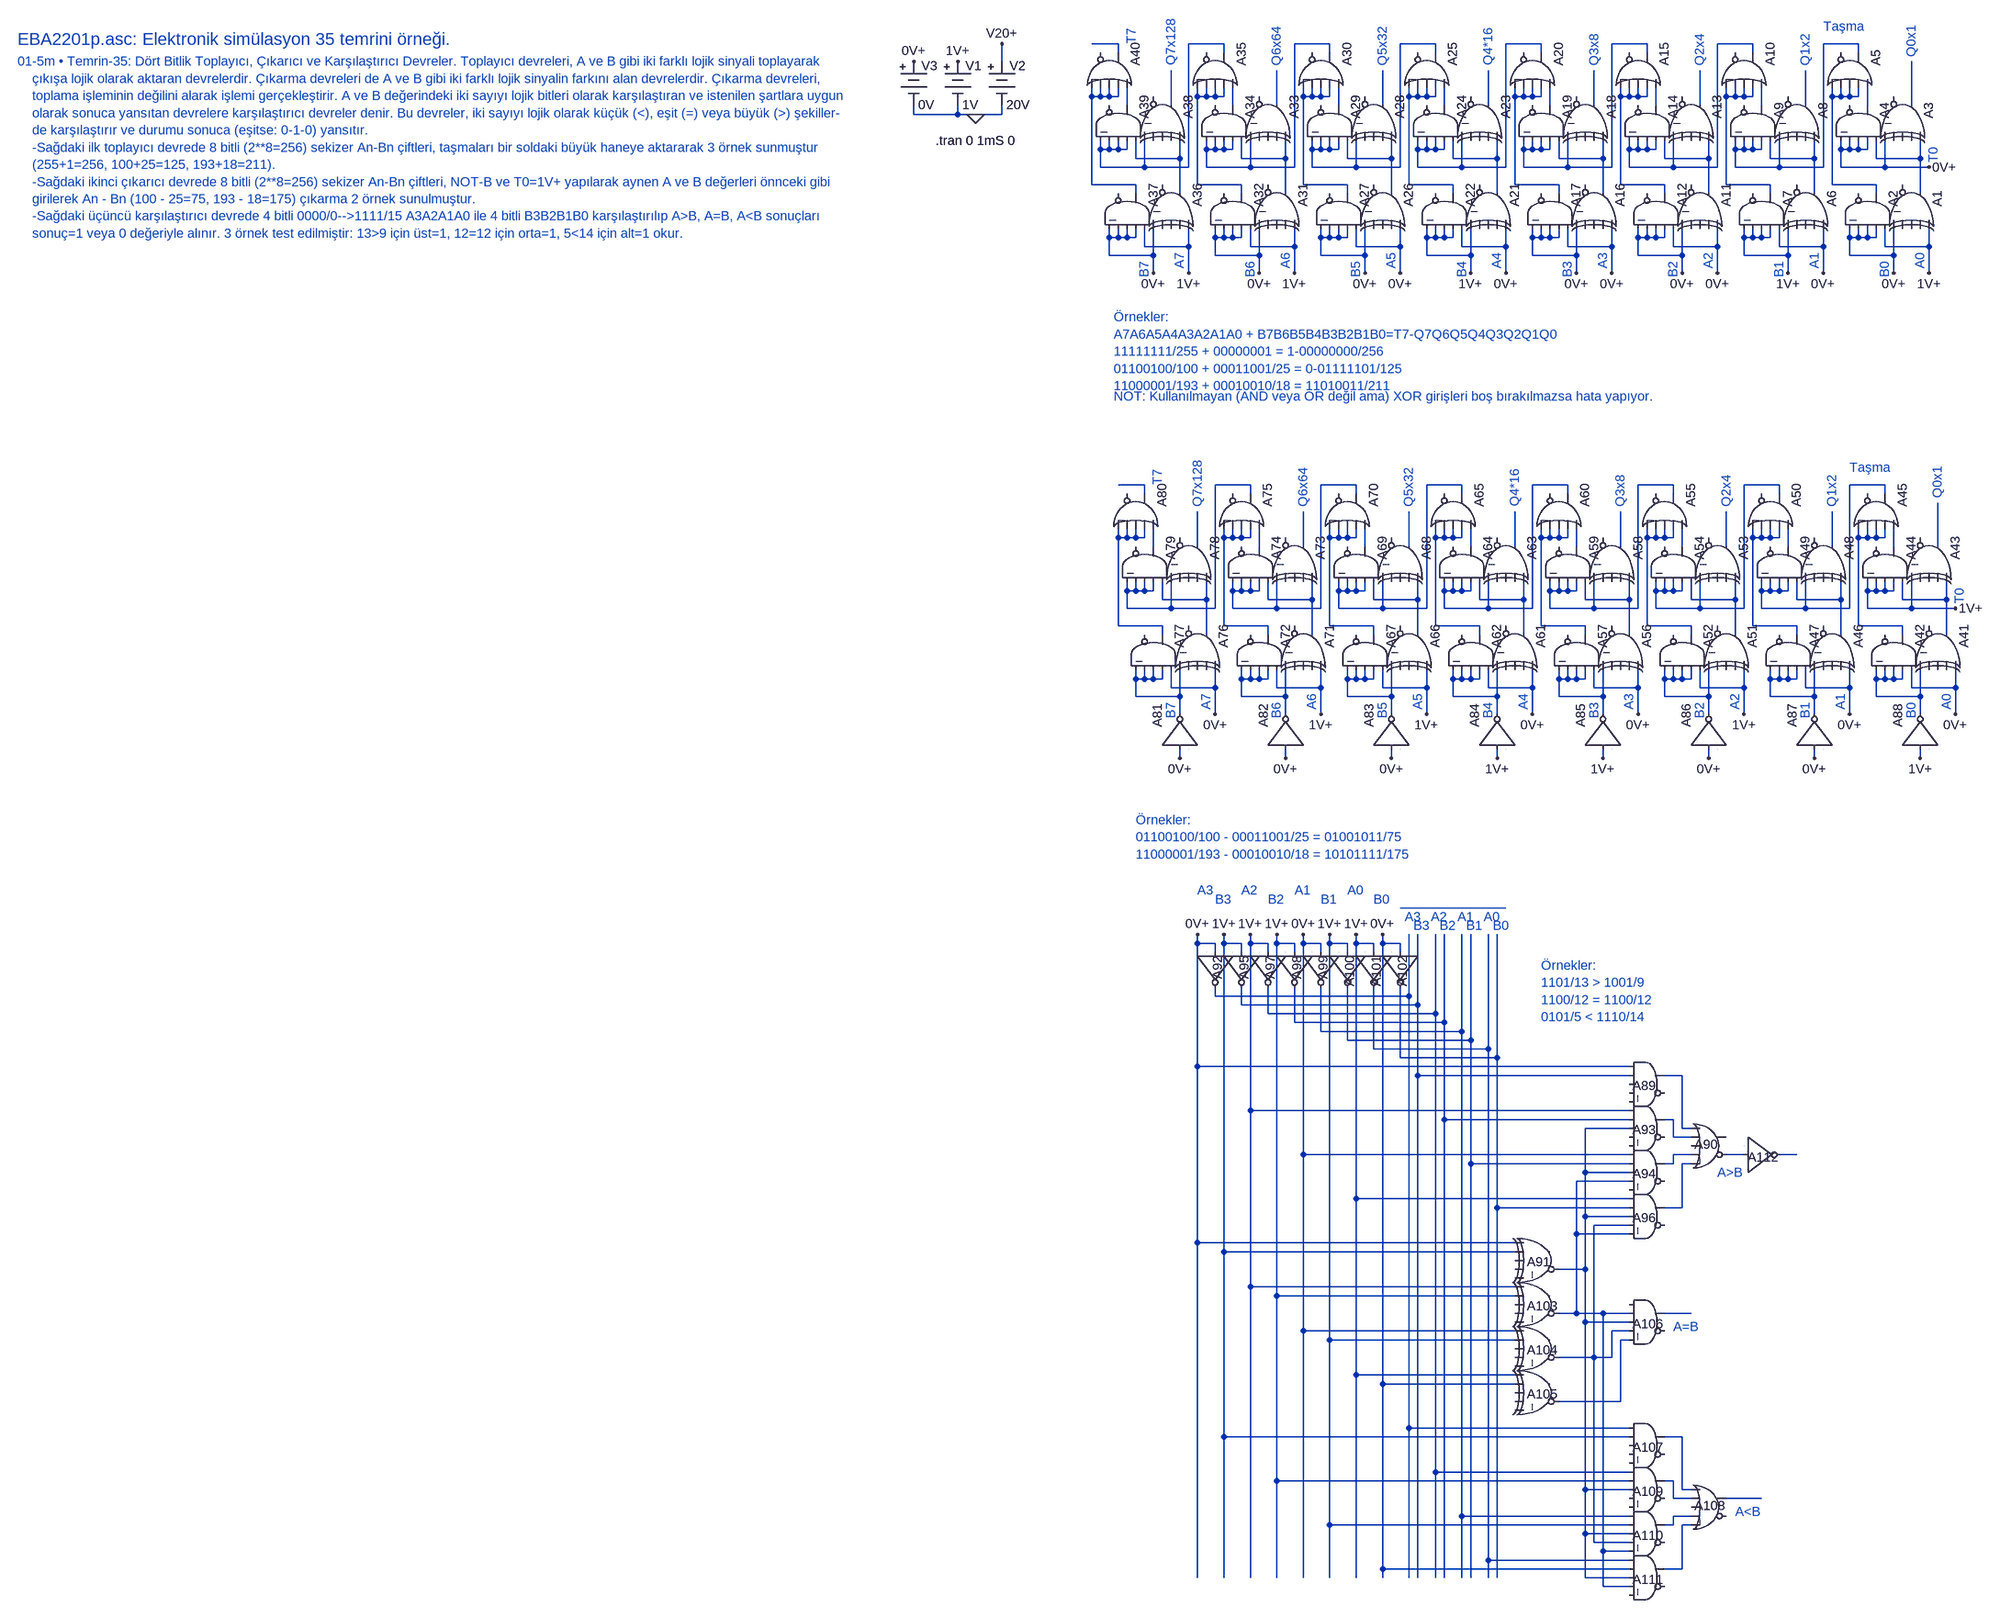
[diagram p0: schematic EBA2201p.asc]
EBA2201p.asc, the LTspice schematic file:
Version 4
SHEET 1 7064 4332
WIRE 2256 64 2208 64
WIRE 2448 64 2384 64
WIRE 2640 64 2576 64
WIRE 2832 64 2768 64
WIRE 3024 64 2960 64
WIRE 3216 64 3152 64
WIRE 3408 64 3344 64
WIRE 3600 64 3536 64
WIRE 2256 80 2256 64
WIRE 2448 80 2448 64
WIRE 2640 80 2640 64
WIRE 2832 80 2832 64
WIRE 3024 80 3024 64
WIRE 3216 80 3216 64
WIRE 3408 80 3408 64
WIRE 3600 80 3600 64
WIRE 1920 96 1920 64
WIRE 2208 160 2208 144
WIRE 2224 160 2224 144
WIRE 2224 160 2208 160
WIRE 2240 160 2240 144
WIRE 2240 160 2224 160
WIRE 2256 160 2256 144
WIRE 2256 160 2240 160
WIRE 2400 160 2400 144
WIRE 2416 160 2416 144
WIRE 2416 160 2400 160
WIRE 2432 160 2432 144
WIRE 2432 160 2416 160
WIRE 2448 160 2448 144
WIRE 2448 160 2432 160
WIRE 2592 160 2592 144
WIRE 2608 160 2608 144
WIRE 2608 160 2592 160
WIRE 2624 160 2624 144
WIRE 2624 160 2608 160
WIRE 2640 160 2640 144
WIRE 2640 160 2624 160
WIRE 2784 160 2784 144
WIRE 2800 160 2800 144
WIRE 2800 160 2784 160
WIRE 2816 160 2816 144
WIRE 2816 160 2800 160
WIRE 2832 160 2832 144
WIRE 2832 160 2816 160
WIRE 2976 160 2976 144
WIRE 2992 160 2992 144
WIRE 2992 160 2976 160
WIRE 3008 160 3008 144
WIRE 3008 160 2992 160
WIRE 3024 160 3024 144
WIRE 3024 160 3008 160
WIRE 3168 160 3168 144
WIRE 3184 160 3184 144
WIRE 3184 160 3168 160
WIRE 3200 160 3200 144
WIRE 3200 160 3184 160
WIRE 3216 160 3216 144
WIRE 3216 160 3200 160
WIRE 3360 160 3360 144
WIRE 3376 160 3376 144
WIRE 3376 160 3360 160
WIRE 3392 160 3392 144
WIRE 3392 160 3376 160
WIRE 3408 160 3408 144
WIRE 3408 160 3392 160
WIRE 3552 160 3552 144
WIRE 3568 160 3568 144
WIRE 3568 160 3552 160
WIRE 3584 160 3584 144
WIRE 3584 160 3568 160
WIRE 3600 160 3600 144
WIRE 3600 160 3584 160
WIRE 2272 176 2272 144
WIRE 2352 176 2352 112
WIRE 2464 176 2464 144
WIRE 2544 176 2544 112
WIRE 2656 176 2656 144
WIRE 2736 176 2736 112
WIRE 2848 176 2848 144
WIRE 2928 176 2928 112
WIRE 3040 176 3040 144
WIRE 3120 176 3120 112
WIRE 3232 176 3232 144
WIRE 3312 176 3312 112
WIRE 3424 176 3424 144
WIRE 3504 176 3504 112
WIRE 3616 176 3616 144
WIRE 3696 176 3696 96
WIRE 1760 192 1760 176
WIRE 1840 192 1840 176
WIRE 1840 192 1760 192
WIRE 1872 192 1840 192
WIRE 1920 192 1920 176
WIRE 1920 192 1872 192
WIRE 2224 256 2224 240
WIRE 2240 256 2240 240
WIRE 2240 256 2224 256
WIRE 2256 256 2256 240
WIRE 2256 256 2240 256
WIRE 2272 256 2272 240
WIRE 2272 256 2256 256
WIRE 2416 256 2416 240
WIRE 2432 256 2432 240
WIRE 2432 256 2416 256
WIRE 2448 256 2448 240
WIRE 2448 256 2432 256
WIRE 2464 256 2464 240
WIRE 2464 256 2448 256
WIRE 2608 256 2608 240
WIRE 2624 256 2624 240
WIRE 2624 256 2608 256
WIRE 2640 256 2640 240
WIRE 2640 256 2624 256
WIRE 2656 256 2656 240
WIRE 2656 256 2640 256
WIRE 2800 256 2800 240
WIRE 2816 256 2816 240
WIRE 2816 256 2800 256
WIRE 2832 256 2832 240
WIRE 2832 256 2816 256
WIRE 2848 256 2848 240
WIRE 2848 256 2832 256
WIRE 2992 256 2992 240
WIRE 3008 256 3008 240
WIRE 3008 256 2992 256
WIRE 3024 256 3024 240
WIRE 3024 256 3008 256
WIRE 3040 256 3040 240
WIRE 3040 256 3024 256
WIRE 3184 256 3184 240
WIRE 3200 256 3200 240
WIRE 3200 256 3184 256
WIRE 3216 256 3216 240
WIRE 3216 256 3200 256
WIRE 3232 256 3232 240
WIRE 3232 256 3216 256
WIRE 3376 256 3376 240
WIRE 3392 256 3392 240
WIRE 3392 256 3376 256
WIRE 3408 256 3408 240
WIRE 3408 256 3392 256
WIRE 3424 256 3424 240
WIRE 3424 256 3408 256
WIRE 3568 256 3568 240
WIRE 3584 256 3584 240
WIRE 3584 256 3568 256
WIRE 3600 256 3600 240
WIRE 3600 256 3584 256
WIRE 3616 256 3616 240
WIRE 3616 256 3600 256
WIRE 2288 272 2288 240
WIRE 2368 272 2368 240
WIRE 2368 272 2288 272
WIRE 2480 272 2480 240
WIRE 2560 272 2560 240
WIRE 2560 272 2480 272
WIRE 2672 272 2672 240
WIRE 2752 272 2752 240
WIRE 2752 272 2672 272
WIRE 2864 272 2864 240
WIRE 2944 272 2944 240
WIRE 2944 272 2864 272
WIRE 3056 272 3056 240
WIRE 3136 272 3136 240
WIRE 3136 272 3056 272
WIRE 3248 272 3248 240
WIRE 3328 272 3328 240
WIRE 3328 272 3248 272
WIRE 3440 272 3440 240
WIRE 3520 272 3520 240
WIRE 3520 272 3440 272
WIRE 3632 272 3632 240
WIRE 3712 272 3712 240
WIRE 3712 272 3632 272
WIRE 2224 288 2224 256
WIRE 2304 288 2304 240
WIRE 2304 288 2224 288
WIRE 2384 288 2384 64
WIRE 2384 288 2304 288
WIRE 2416 288 2416 256
WIRE 2496 288 2496 240
WIRE 2496 288 2416 288
WIRE 2576 288 2576 64
WIRE 2576 288 2496 288
WIRE 2608 288 2608 256
WIRE 2688 288 2688 240
WIRE 2688 288 2608 288
WIRE 2768 288 2768 64
WIRE 2768 288 2688 288
WIRE 2800 288 2800 256
WIRE 2880 288 2880 240
WIRE 2880 288 2800 288
WIRE 2960 288 2960 64
WIRE 2960 288 2880 288
WIRE 2992 288 2992 256
WIRE 3072 288 3072 240
WIRE 3072 288 2992 288
WIRE 3152 288 3152 64
WIRE 3152 288 3072 288
WIRE 3184 288 3184 256
WIRE 3264 288 3264 240
WIRE 3264 288 3184 288
WIRE 3344 288 3344 64
WIRE 3344 288 3264 288
WIRE 3376 288 3376 256
WIRE 3456 288 3456 240
WIRE 3456 288 3376 288
WIRE 3536 288 3536 64
WIRE 3536 288 3456 288
WIRE 3568 288 3568 256
WIRE 3648 288 3648 240
WIRE 3648 288 3568 288
WIRE 3728 288 3648 288
WIRE 2208 320 2208 160
WIRE 2288 320 2208 320
WIRE 2400 320 2400 160
WIRE 2480 320 2400 320
WIRE 2592 320 2592 160
WIRE 2672 320 2592 320
WIRE 2784 320 2784 160
WIRE 2864 320 2784 320
WIRE 2976 320 2976 160
WIRE 3056 320 2976 320
WIRE 3168 320 3168 160
WIRE 3248 320 3168 320
WIRE 3360 320 3360 160
WIRE 3440 320 3360 320
WIRE 3552 320 3552 160
WIRE 3632 320 3552 320
WIRE 2288 336 2288 320
WIRE 2368 336 2368 272
WIRE 2480 336 2480 320
WIRE 2560 336 2560 272
WIRE 2672 336 2672 320
WIRE 2752 336 2752 272
WIRE 2864 336 2864 320
WIRE 2944 336 2944 272
WIRE 3056 336 3056 320
WIRE 3136 336 3136 272
WIRE 3248 336 3248 320
WIRE 3328 336 3328 272
WIRE 3440 336 3440 320
WIRE 3520 336 3520 272
WIRE 3632 336 3632 320
WIRE 3712 336 3712 272
WIRE 2240 416 2240 400
WIRE 2256 416 2256 400
WIRE 2256 416 2240 416
WIRE 2272 416 2272 400
WIRE 2272 416 2256 416
WIRE 2288 416 2288 400
WIRE 2288 416 2272 416
WIRE 2432 416 2432 400
WIRE 2448 416 2448 400
WIRE 2448 416 2432 416
WIRE 2464 416 2464 400
WIRE 2464 416 2448 416
WIRE 2480 416 2480 400
WIRE 2480 416 2464 416
WIRE 2624 416 2624 400
WIRE 2640 416 2640 400
WIRE 2640 416 2624 416
WIRE 2656 416 2656 400
WIRE 2656 416 2640 416
WIRE 2672 416 2672 400
WIRE 2672 416 2656 416
WIRE 2816 416 2816 400
WIRE 2832 416 2832 400
WIRE 2832 416 2816 416
WIRE 2848 416 2848 400
WIRE 2848 416 2832 416
WIRE 2864 416 2864 400
WIRE 2864 416 2848 416
WIRE 3008 416 3008 400
WIRE 3024 416 3024 400
WIRE 3024 416 3008 416
WIRE 3040 416 3040 400
WIRE 3040 416 3024 416
WIRE 3056 416 3056 400
WIRE 3056 416 3040 416
WIRE 3200 416 3200 400
WIRE 3216 416 3216 400
WIRE 3216 416 3200 416
WIRE 3232 416 3232 400
WIRE 3232 416 3216 416
WIRE 3248 416 3248 400
WIRE 3248 416 3232 416
WIRE 3392 416 3392 400
WIRE 3408 416 3408 400
WIRE 3408 416 3392 416
WIRE 3424 416 3424 400
WIRE 3424 416 3408 416
WIRE 3440 416 3440 400
WIRE 3440 416 3424 416
WIRE 3584 416 3584 400
WIRE 3600 416 3600 400
WIRE 3600 416 3584 416
WIRE 3616 416 3616 400
WIRE 3616 416 3600 416
WIRE 3632 416 3632 400
WIRE 3632 416 3616 416
WIRE 2304 432 2304 400
WIRE 2384 432 2384 400
WIRE 2384 432 2304 432
WIRE 2496 432 2496 400
WIRE 2576 432 2576 400
WIRE 2576 432 2496 432
WIRE 2688 432 2688 400
WIRE 2768 432 2768 400
WIRE 2768 432 2688 432
WIRE 2880 432 2880 400
WIRE 2960 432 2960 400
WIRE 2960 432 2880 432
WIRE 3072 432 3072 400
WIRE 3152 432 3152 400
WIRE 3152 432 3072 432
WIRE 3264 432 3264 400
WIRE 3344 432 3344 400
WIRE 3344 432 3264 432
WIRE 3456 432 3456 400
WIRE 3536 432 3536 400
WIRE 3536 432 3456 432
WIRE 3648 432 3648 400
WIRE 3728 432 3728 400
WIRE 3728 432 3648 432
WIRE 2240 448 2240 416
WIRE 2320 448 2320 400
WIRE 2320 448 2240 448
WIRE 2432 448 2432 416
WIRE 2512 448 2512 400
WIRE 2512 448 2432 448
WIRE 2624 448 2624 416
WIRE 2704 448 2704 400
WIRE 2704 448 2624 448
WIRE 2816 448 2816 416
WIRE 2896 448 2896 400
WIRE 2896 448 2816 448
WIRE 3008 448 3008 416
WIRE 3088 448 3088 400
WIRE 3088 448 3008 448
WIRE 3200 448 3200 416
WIRE 3280 448 3280 400
WIRE 3280 448 3200 448
WIRE 3392 448 3392 416
WIRE 3472 448 3472 400
WIRE 3472 448 3392 448
WIRE 3584 448 3584 416
WIRE 3664 448 3664 400
WIRE 3664 448 3584 448
WIRE 2320 480 2320 448
WIRE 2384 480 2384 432
WIRE 2512 480 2512 448
WIRE 2576 480 2576 432
WIRE 2704 480 2704 448
WIRE 2768 480 2768 432
WIRE 2896 480 2896 448
WIRE 2960 480 2960 432
WIRE 3088 480 3088 448
WIRE 3152 480 3152 432
WIRE 3280 480 3280 448
WIRE 3344 480 3344 432
WIRE 3472 480 3472 448
WIRE 3536 480 3536 432
WIRE 3664 480 3664 448
WIRE 3728 480 3728 432
WIRE 2304 880 2256 880
WIRE 2496 880 2432 880
WIRE 2688 880 2624 880
WIRE 2880 880 2816 880
WIRE 3072 880 3008 880
WIRE 3264 880 3200 880
WIRE 3456 880 3392 880
WIRE 3648 880 3584 880
WIRE 2304 896 2304 880
WIRE 2496 896 2496 880
WIRE 2688 896 2688 880
WIRE 2880 896 2880 880
WIRE 3072 896 3072 880
WIRE 3264 896 3264 880
WIRE 3456 896 3456 880
WIRE 3648 896 3648 880
WIRE 2256 976 2256 960
WIRE 2272 976 2272 960
WIRE 2272 976 2256 976
WIRE 2288 976 2288 960
WIRE 2288 976 2272 976
WIRE 2304 976 2304 960
WIRE 2304 976 2288 976
WIRE 2448 976 2448 960
WIRE 2464 976 2464 960
WIRE 2464 976 2448 976
WIRE 2480 976 2480 960
WIRE 2480 976 2464 976
WIRE 2496 976 2496 960
WIRE 2496 976 2480 976
WIRE 2640 976 2640 960
WIRE 2656 976 2656 960
WIRE 2656 976 2640 976
WIRE 2672 976 2672 960
WIRE 2672 976 2656 976
WIRE 2688 976 2688 960
WIRE 2688 976 2672 976
WIRE 2832 976 2832 960
WIRE 2848 976 2848 960
WIRE 2848 976 2832 976
WIRE 2864 976 2864 960
WIRE 2864 976 2848 976
WIRE 2880 976 2880 960
WIRE 2880 976 2864 976
WIRE 3024 976 3024 960
WIRE 3040 976 3040 960
WIRE 3040 976 3024 976
WIRE 3056 976 3056 960
WIRE 3056 976 3040 976
WIRE 3072 976 3072 960
WIRE 3072 976 3056 976
WIRE 3216 976 3216 960
WIRE 3232 976 3232 960
WIRE 3232 976 3216 976
WIRE 3248 976 3248 960
WIRE 3248 976 3232 976
WIRE 3264 976 3264 960
WIRE 3264 976 3248 976
WIRE 3408 976 3408 960
WIRE 3424 976 3424 960
WIRE 3424 976 3408 976
WIRE 3440 976 3440 960
WIRE 3440 976 3424 976
WIRE 3456 976 3456 960
WIRE 3456 976 3440 976
WIRE 3600 976 3600 960
WIRE 3616 976 3616 960
WIRE 3616 976 3600 976
WIRE 3632 976 3632 960
WIRE 3632 976 3616 976
WIRE 3648 976 3648 960
WIRE 3648 976 3632 976
WIRE 2320 992 2320 960
WIRE 2400 992 2400 928
WIRE 2512 992 2512 960
WIRE 2592 992 2592 928
WIRE 2704 992 2704 960
WIRE 2784 992 2784 928
WIRE 2896 992 2896 960
WIRE 2976 992 2976 928
WIRE 3088 992 3088 960
WIRE 3168 992 3168 928
WIRE 3280 992 3280 960
WIRE 3360 992 3360 928
WIRE 3472 992 3472 960
WIRE 3552 992 3552 928
WIRE 3664 992 3664 960
WIRE 3744 992 3744 912
WIRE 2272 1072 2272 1056
WIRE 2288 1072 2288 1056
WIRE 2288 1072 2272 1072
WIRE 2304 1072 2304 1056
WIRE 2304 1072 2288 1072
WIRE 2320 1072 2320 1056
WIRE 2320 1072 2304 1072
WIRE 2464 1072 2464 1056
WIRE 2480 1072 2480 1056
WIRE 2480 1072 2464 1072
WIRE 2496 1072 2496 1056
WIRE 2496 1072 2480 1072
WIRE 2512 1072 2512 1056
WIRE 2512 1072 2496 1072
WIRE 2656 1072 2656 1056
WIRE 2672 1072 2672 1056
WIRE 2672 1072 2656 1072
WIRE 2688 1072 2688 1056
WIRE 2688 1072 2672 1072
WIRE 2704 1072 2704 1056
WIRE 2704 1072 2688 1072
WIRE 2848 1072 2848 1056
WIRE 2864 1072 2864 1056
WIRE 2864 1072 2848 1072
WIRE 2880 1072 2880 1056
WIRE 2880 1072 2864 1072
WIRE 2896 1072 2896 1056
WIRE 2896 1072 2880 1072
WIRE 3040 1072 3040 1056
WIRE 3056 1072 3056 1056
WIRE 3056 1072 3040 1072
WIRE 3072 1072 3072 1056
WIRE 3072 1072 3056 1072
WIRE 3088 1072 3088 1056
WIRE 3088 1072 3072 1072
WIRE 3232 1072 3232 1056
WIRE 3248 1072 3248 1056
WIRE 3248 1072 3232 1072
WIRE 3264 1072 3264 1056
WIRE 3264 1072 3248 1072
WIRE 3280 1072 3280 1056
WIRE 3280 1072 3264 1072
WIRE 3424 1072 3424 1056
WIRE 3440 1072 3440 1056
WIRE 3440 1072 3424 1072
WIRE 3456 1072 3456 1056
WIRE 3456 1072 3440 1072
WIRE 3472 1072 3472 1056
WIRE 3472 1072 3456 1072
WIRE 3616 1072 3616 1056
WIRE 3632 1072 3632 1056
WIRE 3632 1072 3616 1072
WIRE 3648 1072 3648 1056
WIRE 3648 1072 3632 1072
WIRE 3664 1072 3664 1056
WIRE 3664 1072 3648 1072
WIRE 2336 1088 2336 1056
WIRE 2416 1088 2416 1056
WIRE 2416 1088 2336 1088
WIRE 2528 1088 2528 1056
WIRE 2608 1088 2608 1056
WIRE 2608 1088 2528 1088
WIRE 2720 1088 2720 1056
WIRE 2800 1088 2800 1056
WIRE 2800 1088 2720 1088
WIRE 2912 1088 2912 1056
WIRE 2992 1088 2992 1056
WIRE 2992 1088 2912 1088
WIRE 3104 1088 3104 1056
WIRE 3184 1088 3184 1056
WIRE 3184 1088 3104 1088
WIRE 3296 1088 3296 1056
WIRE 3376 1088 3376 1056
WIRE 3376 1088 3296 1088
WIRE 3488 1088 3488 1056
WIRE 3568 1088 3568 1056
WIRE 3568 1088 3488 1088
WIRE 3680 1088 3680 1056
WIRE 3760 1088 3760 1056
WIRE 3760 1088 3680 1088
WIRE 2272 1104 2272 1072
WIRE 2352 1104 2352 1056
WIRE 2352 1104 2272 1104
WIRE 2432 1104 2432 880
WIRE 2432 1104 2352 1104
WIRE 2464 1104 2464 1072
WIRE 2544 1104 2544 1056
WIRE 2544 1104 2464 1104
WIRE 2624 1104 2624 880
WIRE 2624 1104 2544 1104
WIRE 2656 1104 2656 1072
WIRE 2736 1104 2736 1056
WIRE 2736 1104 2656 1104
WIRE 2816 1104 2816 880
WIRE 2816 1104 2736 1104
WIRE 2848 1104 2848 1072
WIRE 2928 1104 2928 1056
WIRE 2928 1104 2848 1104
WIRE 3008 1104 3008 880
WIRE 3008 1104 2928 1104
WIRE 3040 1104 3040 1072
WIRE 3120 1104 3120 1056
WIRE 3120 1104 3040 1104
WIRE 3200 1104 3200 880
WIRE 3200 1104 3120 1104
WIRE 3232 1104 3232 1072
WIRE 3312 1104 3312 1056
WIRE 3312 1104 3232 1104
WIRE 3392 1104 3392 880
WIRE 3392 1104 3312 1104
WIRE 3424 1104 3424 1072
WIRE 3504 1104 3504 1056
WIRE 3504 1104 3424 1104
WIRE 3584 1104 3584 880
WIRE 3584 1104 3504 1104
WIRE 3616 1104 3616 1072
WIRE 3696 1104 3696 1056
WIRE 3696 1104 3616 1104
WIRE 3776 1104 3696 1104
WIRE 2256 1136 2256 976
WIRE 2336 1136 2256 1136
WIRE 2448 1136 2448 976
WIRE 2528 1136 2448 1136
WIRE 2640 1136 2640 976
WIRE 2720 1136 2640 1136
WIRE 2832 1136 2832 976
WIRE 2912 1136 2832 1136
WIRE 3024 1136 3024 976
WIRE 3104 1136 3024 1136
WIRE 3216 1136 3216 976
WIRE 3296 1136 3216 1136
WIRE 3408 1136 3408 976
WIRE 3488 1136 3408 1136
WIRE 3600 1136 3600 976
WIRE 3680 1136 3600 1136
WIRE 2336 1152 2336 1136
WIRE 2416 1152 2416 1088
WIRE 2528 1152 2528 1136
WIRE 2608 1152 2608 1088
WIRE 2720 1152 2720 1136
WIRE 2800 1152 2800 1088
WIRE 2912 1152 2912 1136
WIRE 2992 1152 2992 1088
WIRE 3104 1152 3104 1136
WIRE 3184 1152 3184 1088
WIRE 3296 1152 3296 1136
WIRE 3376 1152 3376 1088
WIRE 3488 1152 3488 1136
WIRE 3568 1152 3568 1088
WIRE 3680 1152 3680 1136
WIRE 3760 1152 3760 1088
WIRE 2288 1232 2288 1216
WIRE 2304 1232 2304 1216
WIRE 2304 1232 2288 1232
WIRE 2320 1232 2320 1216
WIRE 2320 1232 2304 1232
WIRE 2336 1232 2336 1216
WIRE 2336 1232 2320 1232
WIRE 2480 1232 2480 1216
WIRE 2496 1232 2496 1216
WIRE 2496 1232 2480 1232
WIRE 2512 1232 2512 1216
WIRE 2512 1232 2496 1232
WIRE 2528 1232 2528 1216
WIRE 2528 1232 2512 1232
WIRE 2672 1232 2672 1216
WIRE 2688 1232 2688 1216
WIRE 2688 1232 2672 1232
WIRE 2704 1232 2704 1216
WIRE 2704 1232 2688 1232
WIRE 2720 1232 2720 1216
WIRE 2720 1232 2704 1232
WIRE 2864 1232 2864 1216
WIRE 2880 1232 2880 1216
WIRE 2880 1232 2864 1232
WIRE 2896 1232 2896 1216
WIRE 2896 1232 2880 1232
WIRE 2912 1232 2912 1216
WIRE 2912 1232 2896 1232
WIRE 3056 1232 3056 1216
WIRE 3072 1232 3072 1216
WIRE 3072 1232 3056 1232
WIRE 3088 1232 3088 1216
WIRE 3088 1232 3072 1232
WIRE 3104 1232 3104 1216
WIRE 3104 1232 3088 1232
WIRE 3248 1232 3248 1216
WIRE 3264 1232 3264 1216
WIRE 3264 1232 3248 1232
WIRE 3280 1232 3280 1216
WIRE 3280 1232 3264 1232
WIRE 3296 1232 3296 1216
WIRE 3296 1232 3280 1232
WIRE 3440 1232 3440 1216
WIRE 3456 1232 3456 1216
WIRE 3456 1232 3440 1232
WIRE 3472 1232 3472 1216
WIRE 3472 1232 3456 1232
WIRE 3488 1232 3488 1216
WIRE 3488 1232 3472 1232
WIRE 3632 1232 3632 1216
WIRE 3648 1232 3648 1216
WIRE 3648 1232 3632 1232
WIRE 3664 1232 3664 1216
WIRE 3664 1232 3648 1232
WIRE 3680 1232 3680 1216
WIRE 3680 1232 3664 1232
WIRE 2352 1248 2352 1216
WIRE 2432 1248 2432 1216
WIRE 2432 1248 2352 1248
WIRE 2544 1248 2544 1216
WIRE 2624 1248 2624 1216
WIRE 2624 1248 2544 1248
WIRE 2736 1248 2736 1216
WIRE 2816 1248 2816 1216
WIRE 2816 1248 2736 1248
WIRE 2928 1248 2928 1216
WIRE 3008 1248 3008 1216
WIRE 3008 1248 2928 1248
WIRE 3120 1248 3120 1216
WIRE 3200 1248 3200 1216
WIRE 3200 1248 3120 1248
WIRE 3312 1248 3312 1216
WIRE 3392 1248 3392 1216
WIRE 3392 1248 3312 1248
WIRE 3504 1248 3504 1216
WIRE 3584 1248 3584 1216
WIRE 3584 1248 3504 1248
WIRE 3696 1248 3696 1216
WIRE 3776 1248 3776 1216
WIRE 3776 1248 3696 1248
WIRE 2288 1264 2288 1232
WIRE 2368 1264 2368 1216
WIRE 2368 1264 2288 1264
WIRE 2480 1264 2480 1232
WIRE 2560 1264 2560 1216
WIRE 2560 1264 2480 1264
WIRE 2672 1264 2672 1232
WIRE 2752 1264 2752 1216
WIRE 2752 1264 2672 1264
WIRE 2864 1264 2864 1232
WIRE 2944 1264 2944 1216
WIRE 2944 1264 2864 1264
WIRE 3056 1264 3056 1232
WIRE 3136 1264 3136 1216
WIRE 3136 1264 3056 1264
WIRE 3248 1264 3248 1232
WIRE 3328 1264 3328 1216
WIRE 3328 1264 3248 1264
WIRE 3440 1264 3440 1232
WIRE 3520 1264 3520 1216
WIRE 3520 1264 3440 1264
WIRE 3632 1264 3632 1232
WIRE 3712 1264 3712 1216
WIRE 3712 1264 3632 1264
WIRE 2368 1296 2368 1264
WIRE 2432 1296 2432 1248
WIRE 2560 1296 2560 1264
WIRE 2624 1296 2624 1248
WIRE 2752 1296 2752 1264
WIRE 2816 1296 2816 1248
WIRE 2944 1296 2944 1264
WIRE 3008 1296 3008 1248
WIRE 3136 1296 3136 1264
WIRE 3200 1296 3200 1248
WIRE 3328 1296 3328 1264
WIRE 3392 1296 3392 1248
WIRE 3520 1296 3520 1264
WIRE 3584 1296 3584 1248
WIRE 3712 1296 3712 1264
WIRE 3776 1296 3776 1248
WIRE 2368 1376 2368 1360
WIRE 2560 1376 2560 1360
WIRE 2752 1376 2752 1360
WIRE 2944 1376 2944 1360
WIRE 3136 1376 3136 1360
WIRE 3328 1376 3328 1360
WIRE 3520 1376 3520 1360
WIRE 3712 1376 3712 1360
WIRE 2400 1712 2400 1696
WIRE 2432 1712 2400 1712
WIRE 2448 1712 2448 1696
WIRE 2480 1712 2448 1712
WIRE 2496 1712 2496 1696
WIRE 2528 1712 2496 1712
WIRE 2544 1712 2544 1696
WIRE 2576 1712 2544 1712
WIRE 2592 1712 2592 1696
WIRE 2624 1712 2592 1712
WIRE 2640 1712 2640 1696
WIRE 2672 1712 2640 1712
WIRE 2688 1712 2688 1696
WIRE 2720 1712 2688 1712
WIRE 2736 1712 2736 1696
WIRE 2768 1712 2736 1712
WIRE 2432 1728 2432 1712
WIRE 2480 1728 2480 1712
WIRE 2528 1728 2528 1712
WIRE 2576 1728 2576 1712
WIRE 2624 1728 2624 1712
WIRE 2672 1728 2672 1712
WIRE 2720 1728 2720 1712
WIRE 2768 1728 2768 1712
WIRE 2432 1808 2432 1792
WIRE 2784 1808 2784 1696
WIRE 2784 1808 2432 1808
WIRE 2480 1824 2480 1792
WIRE 2800 1824 2800 1696
WIRE 2800 1824 2480 1824
WIRE 2528 1840 2528 1792
WIRE 2832 1840 2832 1696
WIRE 2832 1840 2528 1840
WIRE 2576 1856 2576 1792
WIRE 2848 1856 2848 1696
WIRE 2848 1856 2576 1856
WIRE 2624 1872 2624 1792
WIRE 2880 1872 2880 1696
WIRE 2880 1872 2624 1872
WIRE 2672 1888 2672 1792
WIRE 2896 1888 2896 1696
WIRE 2896 1888 2672 1888
WIRE 2720 1904 2720 1792
WIRE 2928 1904 2928 1696
WIRE 2928 1904 2720 1904
WIRE 2768 1920 2768 1792
WIRE 2944 1920 2944 1696
WIRE 2944 1920 2768 1920
WIRE 2400 1936 2400 1712
WIRE 3184 1936 2400 1936
WIRE 2800 1952 2800 1824
WIRE 3184 1952 2800 1952
WIRE 3280 1952 3248 1952
WIRE 2496 2016 2496 1712
WIRE 3184 2016 2496 2016
WIRE 2848 2032 2848 1856
WIRE 3184 2032 2848 2032
WIRE 3264 2032 3248 2032
WIRE 3184 2048 3104 2048
WIRE 3280 2048 3280 1952
WIRE 3296 2048 3280 2048
WIRE 3264 2064 3264 2032
WIRE 3296 2064 3264 2064
WIRE 2592 2096 2592 1712
WIRE 3184 2096 2592 2096
WIRE 3296 2096 3264 2096
WIRE 3392 2096 3360 2096
WIRE 3488 2096 3456 2096
WIRE 2896 2112 2896 1888
WIRE 3184 2112 2896 2112
WIRE 3264 2112 3264 2096
WIRE 3264 2112 3248 2112
WIRE 3296 2112 3280 2112
WIRE 3104 2128 3104 2048
WIRE 3184 2128 3104 2128
WIRE 3184 2144 3088 2144
WIRE 2688 2176 2688 1712
WIRE 3184 2176 2688 2176
WIRE 2944 2192 2944 1920
WIRE 3184 2192 2944 2192
WIRE 3280 2192 3280 2112
WIRE 3280 2192 3248 2192
WIRE 3104 2208 3104 2128
WIRE 3184 2208 3104 2208
WIRE 3184 2224 3120 2224
WIRE 3088 2240 3088 2144
WIRE 3184 2240 3088 2240
WIRE 2400 2256 2400 1936
WIRE 2976 2256 2400 2256
WIRE 2448 2272 2448 1712
WIRE 2976 2272 2448 2272
WIRE 3104 2304 3104 2208
WIRE 3104 2304 3056 2304
WIRE 2496 2336 2496 2016
WIRE 2976 2336 2496 2336
WIRE 2544 2352 2544 1712
WIRE 2976 2352 2544 2352
WIRE 3088 2384 3088 2240
WIRE 3088 2384 3056 2384
WIRE 3136 2384 3088 2384
WIRE 3184 2384 3136 2384
WIRE 3296 2384 3248 2384
WIRE 3104 2400 3104 2304
WIRE 3184 2400 3104 2400
WIRE 2592 2416 2592 2096
WIRE 2976 2416 2592 2416
WIRE 3184 2416 3152 2416
WIRE 2640 2432 2640 1712
WIRE 2976 2432 2640 2432
WIRE 3184 2432 3168 2432
WIRE 3120 2464 3120 2224
WIRE 3120 2464 3056 2464
WIRE 3152 2464 3152 2416
WIRE 3152 2464 3120 2464
WIRE 2688 2496 2688 2176
WIRE 2976 2496 2688 2496
WIRE 2736 2512 2736 1712
WIRE 2976 2512 2736 2512
WIRE 3168 2544 3168 2432
WIRE 3168 2544 3056 2544
WIRE 2784 2592 2784 1808
WIRE 3184 2592 2784 2592
WIRE 2448 2608 2448 2272
WIRE 3184 2608 2448 2608
WIRE 3280 2608 3248 2608
WIRE 2832 2672 2832 1840
WIRE 3184 2672 2832 2672
WIRE 2544 2688 2544 2352
WIRE 3184 2688 2544 2688
WIRE 3264 2688 3248 2688
WIRE 3104 2704 3104 2400
WIRE 3184 2704 3104 2704
WIRE 3280 2704 3280 2608
WIRE 3296 2704 3280 2704
WIRE 3264 2720 3264 2688
WIRE 3296 2720 3264 2720
WIRE 3424 2720 3360 2720
WIRE 2880 2752 2880 1872
WIRE 3184 2752 2880 2752
WIRE 3296 2752 3264 2752
WIRE 2640 2768 2640 2432
WIRE 3184 2768 2640 2768
WIRE 3264 2768 3264 2752
WIRE 3264 2768 3248 2768
WIRE 3296 2768 3280 2768
WIRE 3104 2784 3104 2704
WIRE 3184 2784 3104 2784
WIRE 3120 2800 3120 2464
WIRE 3184 2800 3120 2800
WIRE 3136 2816 3136 2384
WIRE 3184 2816 3136 2816
WIRE 2928 2832 2928 1904
WIRE 3184 2832 2928 2832
WIRE 2736 2848 2736 2512
WIRE 3184 2848 2736 2848
WIRE 3280 2848 3280 2768
WIRE 3280 2848 3248 2848
WIRE 2400 2864 2400 2256
WIRE 2448 2864 2448 2608
WIRE 2496 2864 2496 2336
WIRE 2544 2864 2544 2688
WIRE 2592 2864 2592 2416
WIRE 2640 2864 2640 2768
WIRE 2688 2864 2688 2496
WIRE 2736 2864 2736 2848
WIRE 2784 2864 2784 2592
WIRE 2800 2864 2800 1952
WIRE 2832 2864 2832 2672
WIRE 2848 2864 2848 2032
WIRE 2880 2864 2880 2752
WIRE 2896 2864 2896 2112
WIRE 2928 2864 2928 2832
WIRE 2944 2864 2944 2192
WIRE 3104 2864 3104 2784
WIRE 3184 2864 3104 2864
WIRE 3136 2880 3136 2816
WIRE 3184 2880 3136 2880
FLAG 1840 96 1V+
FLAG 1872 192 0
FLAG 1920 64 V20+
FLAG 3344 480 0V+
FLAG 2768 480 0V+
FLAG 2576 480 1V+
FLAG 3664 480 0V+
FLAG 3088 480 0V+
FLAG 2896 480 1V+
FLAG 1760 96 0V+
FLAG 3728 480 1V+
FLAG 3536 480 0V+
FLAG 3472 480 1V+
FLAG 3280 480 0V+
FLAG 3152 480 0V+
FLAG 2960 480 0V+
FLAG 2704 480 0V+
FLAG 2512 480 0V+
FLAG 2384 480 1V+
FLAG 2320 480 0V+
FLAG 3728 288 0V+
FLAG 3392 1296 1V+
FLAG 2816 1296 1V+
FLAG 2624 1296 1V+
FLAG 3712 1376 1V+
FLAG 3136 1376 1V+
FLAG 2944 1376 1V+
FLAG 3776 1296 0V+
FLAG 3584 1296 0V+
FLAG 3520 1376 0V+
FLAG 3328 1376 0V+
FLAG 3200 1296 0V+
FLAG 3008 1296 0V+
FLAG 2752 1376 0V+
FLAG 2560 1376 0V+
FLAG 2432 1296 0V+
FLAG 2368 1376 0V+
FLAG 3776 1104 1V+
FLAG 2688 1696 1V+
FLAG 2400 1696 0V+
FLAG 2544 1696 1V+
FLAG 2496 1696 1V+
FLAG 2448 1696 1V+
FLAG 2592 1696 0V+
FLAG 2736 1696 0V+
FLAG 2640 1696 1V+
SYMBOL Misc\\battery 1840 80 R0
WINDOW 3 8 95 Left 2
WINDOW 0 14 24 Left 2
SYMATTR Value 1V
SYMATTR InstName V1
SYMBOL Misc\\battery 1920 80 R0
WINDOW 3 8 95 Left 2
WINDOW 0 14 24 Left 2
SYMATTR Value 20V
SYMATTR InstName V2
SYMBOL Digital\\xor 3760 352 M270
SYMATTR InstName A1
SYMBOL Digital\\and 3680 368 M270
SYMATTR InstName A2
SYMBOL Digital\\xor 3744 192 M270
SYMATTR InstName A3
SYMBOL Digital\\and 3664 208 M270
SYMATTR InstName A4
SYMBOL Digital\\or 3648 112 M270
SYMATTR InstName A5
SYMBOL Digital\\xor 3568 352 M270
SYMATTR InstName A6
SYMBOL Digital\\and 3488 368 M270
SYMATTR InstName A7
SYMBOL Digital\\xor 3552 192 M270
SYMATTR InstName A8
SYMBOL Digital\\and 3472 208 M270
SYMATTR InstName A9
SYMBOL Digital\\or 3456 112 M270
SYMATTR InstName A10
SYMBOL Digital\\xor 3376 352 M270
SYMATTR InstName A11
SYMBOL Digital\\and 3296 368 M270
SYMATTR InstName A12
SYMBOL Digital\\xor 3360 192 M270
SYMATTR InstName A13
SYMBOL Digital\\and 3280 208 M270
SYMATTR InstName A14
SYMBOL Digital\\or 3264 112 M270
SYMATTR InstName A15
SYMBOL Digital\\xor 3184 352 M270
SYMATTR InstName A16
SYMBOL Digital\\and 3104 368 M270
SYMATTR InstName A17
SYMBOL Digital\\xor 3168 192 M270
SYMATTR InstName A18
SYMBOL Digital\\and 3088 208 M270
SYMATTR InstName A19
SYMBOL Digital\\or 3072 112 M270
SYMATTR InstName A20
SYMBOL Digital\\xor 2992 352 M270
SYMATTR InstName A21
SYMBOL Digital\\and 2912 368 M270
SYMATTR InstName A22
SYMBOL Digital\\xor 2976 192 M270
SYMATTR InstName A23
SYMBOL Digital\\and 2896 208 M270
SYMATTR InstName A24
SYMBOL Digital\\or 2880 112 M270
SYMATTR InstName A25
SYMBOL Digital\\xor 2800 352 M270
SYMATTR InstName A26
SYMBOL Digital\\and 2720 368 M270
SYMATTR InstName A27
SYMBOL Digital\\xor 2784 192 M270
SYMATTR InstName A28
SYMBOL Digital\\and 2704 208 M270
SYMATTR InstName A29
SYMBOL Digital\\or 2688 112 M270
SYMATTR InstName A30
SYMBOL Digital\\xor 2608 352 M270
SYMATTR InstName A31
SYMBOL Digital\\and 2528 368 M270
SYMATTR InstName A32
SYMBOL Digital\\xor 2592 192 M270
SYMATTR InstName A33
SYMBOL Digital\\and 2512 208 M270
SYMATTR InstName A34
SYMBOL Digital\\or 2496 112 M270
SYMATTR InstName A35
SYMBOL Digital\\xor 2416 352 M270
SYMATTR InstName A36
SYMBOL Digital\\and 2336 368 M270
SYMATTR InstName A37
SYMBOL Digital\\xor 2400 192 M270
SYMATTR InstName A38
SYMBOL Digital\\and 2320 208 M270
SYMATTR InstName A39
SYMBOL Digital\\or 2304 112 M270
SYMATTR InstName A40
SYMBOL Misc\\battery 1760 80 R0
WINDOW 3 8 95 Left 2
WINDOW 0 14 24 Left 2
SYMATTR Value 0V
SYMATTR InstName V3
SYMBOL Digital\\xor 3808 1168 M270
SYMATTR InstName A41
SYMBOL Digital\\and 3728 1184 M270
SYMATTR InstName A42
SYMBOL Digital\\xor 3792 1008 M270
SYMATTR InstName A43
SYMBOL Digital\\and 3712 1024 M270
SYMATTR InstName A44
SYMBOL Digital\\or 3696 928 M270
SYMATTR InstName A45
SYMBOL Digital\\xor 3616 1168 M270
SYMATTR InstName A46
SYMBOL Digital\\and 3536 1184 M270
SYMATTR InstName A47
SYMBOL Digital\\xor 3600 1008 M270
SYMATTR InstName A48
SYMBOL Digital\\and 3520 1024 M270
SYMATTR InstName A49
SYMBOL Digital\\or 3504 928 M270
SYMATTR InstName A50
SYMBOL Digital\\xor 3424 1168 M270
SYMATTR InstName A51
SYMBOL Digital\\and 3344 1184 M270
SYMATTR InstName A52
SYMBOL Digital\\xor 3408 1008 M270
SYMATTR InstName A53
SYMBOL Digital\\and 3328 1024 M270
SYMATTR InstName A54
SYMBOL Digital\\or 3312 928 M270
SYMATTR InstName A55
SYMBOL Digital\\xor 3232 1168 M270
SYMATTR InstName A56
SYMBOL Digital\\and 3152 1184 M270
SYMATTR InstName A57
SYMBOL Digital\\xor 3216 1008 M270
SYMATTR InstName A58
SYMBOL Digital\\and 3136 1024 M270
SYMATTR InstName A59
SYMBOL Digital\\or 3120 928 M270
SYMATTR InstName A60
SYMBOL Digital\\xor 3040 1168 M270
SYMATTR InstName A61
SYMBOL Digital\\and 2960 1184 M270
SYMATTR InstName A62
SYMBOL Digital\\xor 3024 1008 M270
SYMATTR InstName A63
SYMBOL Digital\\and 2944 1024 M270
SYMATTR InstName A64
SYMBOL Digital\\or 2928 928 M270
SYMATTR InstName A65
SYMBOL Digital\\xor 2848 1168 M270
SYMATTR InstName A66
SYMBOL Digital\\and 2768 1184 M270
SYMATTR InstName A67
SYMBOL Digital\\xor 2832 1008 M270
SYMATTR InstName A68
SYMBOL Digital\\and 2752 1024 M270
SYMATTR InstName A69
SYMBOL Digital\\or 2736 928 M270
SYMATTR InstName A70
SYMBOL Digital\\xor 2656 1168 M270
SYMATTR InstName A71
SYMBOL Digital\\and 2576 1184 M270
SYMATTR InstName A72
SYMBOL Digital\\xor 2640 1008 M270
SYMATTR InstName A73
SYMBOL Digital\\and 2560 1024 M270
SYMATTR InstName A74
SYMBOL Digital\\or 2544 928 M270
SYMATTR InstName A75
SYMBOL Digital\\xor 2464 1168 M270
SYMATTR InstName A76
SYMBOL Digital\\and 2384 1184 M270
SYMATTR InstName A77
SYMBOL Digital\\xor 2448 1008 M270
SYMATTR InstName A78
SYMBOL Digital\\and 2368 1024 M270
SYMATTR InstName A79
SYMBOL Digital\\or 2352 928 M270
SYMATTR InstName A80
SYMBOL Digital\\inv 2304 1360 R270
SYMATTR InstName A81
SYMBOL Digital\\inv 2496 1360 R270
SYMATTR InstName A82
SYMBOL Digital\\inv 2688 1360 R270
SYMATTR InstName A83
SYMBOL Digital\\inv 2880 1360 R270
SYMATTR InstName A84
SYMBOL Digital\\inv 3072 1360 R270
SYMATTR InstName A85
SYMBOL Digital\\inv 3264 1360 R270
SYMATTR InstName A86
SYMBOL Digital\\inv 3456 1360 R270
SYMATTR InstName A87
SYMBOL Digital\\inv 3648 1360 R270
SYMATTR InstName A88
SYMBOL Digital\\and 3216 1904 R0
WINDOW 0 -26 67 Left 2
SYMATTR InstName A89
SYMBOL Digital\\or 3328 2016 R0
WINDOW 0 -26 61 Left 2
SYMATTR InstName A90
SYMBOL Digital\\xor 3024 2224 R0
WINDOW 0 -26 67 Left 2
SYMATTR InstName A91
SYMBOL Digital\\inv 2496 1728 R90
WINDOW 0 7 59 Left 2
SYMATTR InstName A92
SYMBOL Digital\\and 3216 1984 R0
WINDOW 0 -26 67 Left 2
SYMATTR InstName A93
SYMBOL Digital\\and 3216 2064 R0
WINDOW 0 -26 67 Left 2
SYMATTR InstName A94
SYMBOL Digital\\inv 2544 1728 R90
WINDOW 0 7 59 Left 2
SYMATTR InstName A95
SYMBOL Digital\\inv 2592 1728 R90
WINDOW 0 7 59 Left 2
SYMATTR InstName A97
SYMBOL Digital\\inv 2640 1728 R90
WINDOW 0 7 59 Left 2
SYMATTR InstName A98
SYMBOL Digital\\inv 2688 1728 R90
WINDOW 0 7 59 Left 2
SYMATTR InstName A99
SYMBOL Digital\\inv 2736 1728 R90
WINDOW 0 7 59 Left 2
SYMATTR InstName A100
SYMBOL Digital\\inv 2784 1728 R90
WINDOW 0 7 59 Left 2
SYMATTR InstName A101
SYMBOL Digital\\inv 2832 1728 R90
WINDOW 0 7 59 Left 2
SYMATTR InstName A102
SYMBOL Digital\\and 3216 2144 R0
WINDOW 0 -26 67 Left 2
SYMATTR InstName A96
SYMBOL Digital\\xor 3024 2304 R0
WINDOW 0 -26 67 Left 2
SYMATTR InstName A103
SYMBOL Digital\\xor 3024 2384 R0
WINDOW 0 -26 67 Left 2
SYMATTR InstName A104
SYMBOL Digital\\xor 3024 2464 R0
WINDOW 0 -26 67 Left 2
SYMATTR InstName A105
SYMBOL Digital\\and 3216 2336 R0
WINDOW 0 -26 67 Left 2
SYMATTR InstName A106
SYMBOL Digital\\and 3216 2560 R0
WINDOW 0 -26 67 Left 2
SYMATTR InstName A107
SYMBOL Digital\\or 3328 2672 R0
WINDOW 0 -26 61 Left 2
SYMATTR InstName A108
SYMBOL Digital\\and 3216 2640 R0
WINDOW 0 -26 67 Left 2
SYMATTR InstName A109
SYMBOL Digital\\and 3216 2720 R0
WINDOW 0 -26 67 Left 2
SYMATTR InstName A110
SYMBOL Digital\\and 3216 2800 R0
WINDOW 0 -26 67 Left 2
SYMATTR InstName A111
SYMBOL Digital\\inv 3392 2160 M180
WINDOW 0 7 59 Left 2
SYMATTR InstName A112
TEXT -232 56 Left 3 ;EBA2201p.asc: Elektronik simülasyon 35 temrini örneği.
TEXT -232 96 Left 2 ;01-5m • Temrin-35: Dört Bitlik Toplayıcı, Çıkarıcı ve Karşılaştırıcı Devreler. Toplayıcı devreleri, A ve B gibi iki farklı lojik sinyali toplayarak \n    çıkışa lojik olarak aktaran devrelerdir. Çıkarma devreleri de A ve B gibi iki farklı lojik sinyalin farkını alan devrelerdir. Çıkarma devreleri,\n    toplama işleminin değilini alarak işlemi gerçekleştirir. A ve B değerindeki iki sayıyı lojik bitleri olarak karşılaştıran ve istenilen şartlara uygun \n    olarak sonuca yansıtan devrelere karşılaştırıcı devreler denir. Bu devreler, iki sayıyı lojik olarak küçük (<), eşit (=) veya büyük (>) şekiller-\n    de karşılaştırır ve durumu sonuca (eşitse: 0-1-0) yansıtır.\n    -Sağdaki ilk toplayıcı devrede 8 bitli (2**8=256) sekizer An-Bn çiftleri, taşmaları bir soldaki büyük haneye aktararak 3 örnek sunmuştur \n    (255+1=256, 100+25=125, 193+18=211).\n    -Sağdaki ikinci çıkarıcı devrede 8 bitli (2**8=256) sekizer An-Bn çiftleri, NOT-B ve T0=1V+ yapılarak aynen A ve B değerleri önnceki gibi\n    girilerek An - Bn (100 - 25=75, 193 - 18=175) çıkarma 2 örnek sunulmuştur.\n    -Sağdaki üçüncü karşılaştırıcı devrede 4 bitli 0000/0-->1111/15 A3A2A1A0 ile 4 bitli B3B2B1B0 karşılaştırılıp A>B, A=B, A<B sonuçları\n    sonuç=1 veya 0 değeriyle alınır. 3 örnek test edilmiştir: 13>9 için üst=1, 12=12 için orta=1, 5<14 için alt=1 okur.
TEXT 1800 240 Left 2 !.tran 0 1mS 0
TEXT 3712 472 VLeft 2 ;A0
TEXT 3648 488 VLeft 2 ;B0
TEXT 3696 88 VLeft 2 ;Q0x1
TEXT 3520 472 VLeft 2 ;A1
TEXT 3456 488 VLeft 2 ;B1
TEXT 3504 104 VLeft 2 ;Q1x2
TEXT 3328 472 VLeft 2 ;A2
TEXT 3264 488 VLeft 2 ;B2
TEXT 3312 104 VLeft 2 ;Q2x4
TEXT 3136 472 VLeft 2 ;A3
TEXT 3072 488 VLeft 2 ;B3
TEXT 3120 104 VLeft 2 ;Q3x8
TEXT 2944 472 VLeft 2 ;A4
TEXT 2880 488 VLeft 2 ;B4
TEXT 2928 104 VLeft 2 ;Q4*16
TEXT 2752 472 VLeft 2 ;A5
TEXT 2688 488 VLeft 2 ;B5
TEXT 2736 104 VLeft 2 ;Q5x32
TEXT 2560 472 VLeft 2 ;A6
TEXT 2496 488 VLeft 2 ;B6
TEXT 2544 104 VLeft 2 ;Q6x64
TEXT 2368 472 VLeft 2 ;A7
TEXT 2304 488 VLeft 2 ;B7
TEXT 2352 104 VLeft 2 ;Q7x128
TEXT 2280 64 VLeft 2 ;T7
TEXT 3736 280 VLeft 2 ;T0
TEXT 2248 560 Left 2 ;Örnekler:\nA7A6A5A4A3A2A1A0 + B7B6B5B4B3B2B1B0=T7-Q7Q6Q5Q4Q3Q2Q1Q0\n11111111/255 + 00000001 = 1-00000000/256\n01100100/100 + 00011001/25 = 0-01111101/125\n11000001/193 + 00010010/18 = 11010011/211
TEXT 2248 704 Left 2 ;NOT: Kullanılmayan (AND veya OR değil ama) XOR girişleri boş bırakılmazsa hata yapıyor.
TEXT 3536 32 Left 2 ;Taşma
TEXT 3760 1288 VLeft 2 ;A0
TEXT 3696 1304 VLeft 2 ;B0
TEXT 3744 904 VLeft 2 ;Q0x1
TEXT 3568 1288 VLeft 2 ;A1
TEXT 3504 1304 VLeft 2 ;B1
TEXT 3552 920 VLeft 2 ;Q1x2
TEXT 3376 1288 VLeft 2 ;A2
TEXT 3312 1304 VLeft 2 ;B2
TEXT 3360 920 VLeft 2 ;Q2x4
TEXT 3184 1288 VLeft 2 ;A3
TEXT 3120 1304 VLeft 2 ;B3
TEXT 3168 920 VLeft 2 ;Q3x8
TEXT 2992 1288 VLeft 2 ;A4
TEXT 2928 1304 VLeft 2 ;B4
TEXT 2976 920 VLeft 2 ;Q4*16
TEXT 2800 1288 VLeft 2 ;A5
TEXT 2736 1304 VLeft 2 ;B5
TEXT 2784 920 VLeft 2 ;Q5x32
TEXT 2608 1288 VLeft 2 ;A6
TEXT 2544 1304 VLeft 2 ;B6
TEXT 2592 920 VLeft 2 ;Q6x64
TEXT 2416 1288 VLeft 2 ;A7
TEXT 2352 1304 VLeft 2 ;B7
TEXT 2400 920 VLeft 2 ;Q7x128
TEXT 2328 880 VLeft 2 ;T7
TEXT 3784 1096 VLeft 2 ;T0
TEXT 3584 848 Left 2 ;Taşma
TEXT 2288 1488 Left 2 ;Örnekler:\n01100100/100 - 00011001/25 = 01001011/75\n11000001/193 - 00010010/18 = 10101111/175
TEXT 2672 1616 Left 2 ;A0
TEXT 2720 1632 Left 2 ;B0
TEXT 2576 1616 Left 2 ;A1
TEXT 2624 1632 Left 2 ;B1
TEXT 2480 1616 Left 2 ;A2
TEXT 2528 1632 Left 2 ;B2
TEXT 2400 1616 Left 2 ;A3
TEXT 2432 1632 Left 2 ;B3
TEXT 2920 1664 Left 2 ;A0
TEXT 2936 1680 Left 2 ;B0
TEXT 2872 1664 Left 2 ;A1
TEXT 2888 1680 Left 2 ;B1
TEXT 2824 1664 Left 2 ;A2
TEXT 2840 1680 Left 2 ;B2
TEXT 2776 1664 Left 2 ;A3
TEXT 2792 1680 Left 2 ;B3
TEXT 3344 2128 Left 2 ;A>B
TEXT 3264 2408 Left 2 ;A=B
TEXT 3376 2744 Left 2 ;A<B
TEXT 3024 1752 Left 2 ;Örnekler:\n1101/13 > 1001/9\n1100/12 = 1100/12\n0101/5 < 1110/14
LINE Normal 2960 1648 2768 1648

The netlist it stands for:
* EBA2201p.asc
V1 1V+ 0 1V
V2 V20+ 0 20V
A1 1V+ 0 0 0 0V+ 0 N040 0 XOR
A2 1V+ 0V+ 0V+ 0V+ 0V+ 0 N016 0 AND
A3 N040 0 0 0 0V+ 0 N032 0 XOR
A4 N040 0V+ 0V+ 0V+ 0V+ 0 N031 0 AND
A5 N031 N016 N016 N016 N016 0 N008 0 OR
A6 0V+ 0 0 0 1V+ 0 N039 0 XOR
A7 0V+ 1V+ 1V+ 1V+ 1V+ 0 N015 0 AND
A8 N039 0 0 0 N008 0 N030 0 XOR
A9 N039 N008 N008 N008 N008 0 N029 0 AND
A10 N029 N015 N015 N015 N015 0 N007 0 OR
A11 0V+ 0 0 0 0V+ 0 N038 0 XOR
A12 0V+ 0V+ 0V+ 0V+ 0V+ 0 N014 0 AND
A13 N038 0 0 0 N007 0 N028 0 XOR
A14 N038 N007 N007 N007 N007 0 N027 0 AND
A15 N027 N014 N014 N014 N014 0 N006 0 OR
A16 0V+ 0 0 0 0V+ 0 N037 0 XOR
A17 0V+ 0V+ 0V+ 0V+ 0V+ 0 N013 0 AND
A18 N037 0 0 0 N006 0 N026 0 XOR
A19 N037 N006 N006 N006 N006 0 N025 0 AND
A20 N025 N013 N013 N013 N013 0 N005 0 OR
A21 0V+ 0 0 0 1V+ 0 N036 0 XOR
A22 0V+ 1V+ 1V+ 1V+ 1V+ 0 N012 0 AND
A23 N036 0 0 0 N005 0 N024 0 XOR
A24 N036 N005 N005 N005 N005 0 N023 0 AND
A25 N023 N012 N012 N012 N012 0 N004 0 OR
A26 0V+ 0 0 0 0V+ 0 N035 0 XOR
A27 0V+ 0V+ 0V+ 0V+ 0V+ 0 N011 0 AND
A28 N035 0 0 0 N004 0 N022 0 XOR
A29 N035 N004 N004 N004 N004 0 N021 0 AND
A30 N021 N011 N011 N011 N011 0 N003 0 OR
A31 1V+ 0 0 0 0V+ 0 N034 0 XOR
A32 1V+ 0V+ 0V+ 0V+ 0V+ 0 N010 0 AND
A33 N034 0 0 0 N003 0 N020 0 XOR
A34 N034 N003 N003 N003 N003 0 N019 0 AND
A35 N019 N010 N010 N010 N010 0 N002 0 OR
A36 1V+ 0 0 0 0V+ 0 N033 0 XOR
A37 1V+ 0V+ 0V+ 0V+ 0V+ 0 N009 0 AND
A38 N033 0 0 0 N002 0 N018 0 XOR
A39 N033 N002 N002 N002 N002 0 N017 0 AND
A40 N017 N009 N009 N009 N009 0 N001 0 OR
V3 0V+ 0 0V
A41 0V+ 0 0 0 N088 0 N080 0 XOR
A42 0V+ N088 N088 N088 N088 0 N056 0 AND
A43 N080 0 0 0 1V+ 0 N072 0 XOR
A44 N080 1V+ 1V+ 1V+ 1V+ 0 N071 0 AND
A45 N071 N056 N056 N056 N056 0 N048 0 OR
A46 0V+ 0 0 0 N087 0 N079 0 XOR
A47 0V+ N087 N087 N087 N087 0 N055 0 AND
A48 N079 0 0 0 N048 0 N070 0 XOR
A49 N079 N048 N048 N048 N048 0 N069 0 AND
A50 N069 N055 N055 N055 N055 0 N047 0 OR
A51 1V+ 0 0 0 N086 0 N078 0 XOR
A52 1V+ N086 N086 N086 N086 0 N054 0 AND
A53 N078 0 0 0 N047 0 N068 0 XOR
A54 N078 N047 N047 N047 N047 0 N067 0 AND
A55 N067 N054 N054 N054 N054 0 N046 0 OR
A56 0V+ 0 0 0 N085 0 N077 0 XOR
A57 0V+ N085 N085 N085 N085 0 N053 0 AND
A58 N077 0 0 0 N046 0 N066 0 XOR
A59 N077 N046 N046 N046 N046 0 N065 0 AND
A60 N065 N053 N053 N053 N053 0 N045 0 OR
A61 0V+ 0 0 0 N084 0 N076 0 XOR
A62 0V+ N084 N084 N084 N084 0 N052 0 AND
A63 N076 0 0 0 N045 0 N064 0 XOR
A64 N076 N045 N045 N045 N045 0 N063 0 AND
A65 N063 N052 N052 N052 N052 0 N044 0 OR
A66 1V+ 0 0 0 N083 0 N075 0 XOR
A67 1V+ N083 N083 N083 N083 0 N051 0 AND
A68 N075 0 0 0 N044 0 N062 0 XOR
A69 N075 N044 N044 N044 N044 0 N061 0 AND
A70 N061 N051 N051 N051 N051 0 N043 0 OR
A71 1V+ 0 0 0 N082 0 N074 0 XOR
A72 1V+ N082 N082 N082 N082 0 N050 0 AND
A73 N074 0 0 0 N043 0 N060 0 XOR
A74 N074 N043 N043 N043 N043 0 N059 0 AND
A75 N059 N050 N050 N050 N050 0 N042 0 OR
A76 0V+ 0 0 0 N081 0 N073 0 XOR
A77 0V+ N081 N081 N081 N081 0 N049 0 AND
A78 N073 0 0 0 N042 0 N058 0 XOR
A79 N073 N042 N042 N042 N042 0 N057 0 AND
A80 N057 N049 N049 N049 N049 0 N041 0 OR
A81 0V+ 0 0 0 0 N081 0 0 BUF
A82 0V+ 0 0 0 0 N082 0 0 BUF
A83 0V+ 0 0 0 0 N083 0 0 BUF
A84 1V+ 0 0 0 0 N084 0 0 BUF
A85 1V+ 0 0 0 0 N085 0 0 BUF
A86 0V+ 0 0 0 0 N086 0 0 BUF
A87 0V+ 0 0 0 0 N087 0 0 BUF
A88 1V+ 0 0 0 0 N088 0 0 BUF
A89 0V+ N090 0 0 0 0 N097 0 AND
A90 N097 N098 0 N100 N103 N101 0 0 OR
A91 0V+ 1V+ 0 0 0 N099 0 0 XOR
A92 0V+ 0 0 0 0 N089 0 0 BUF
A93 1V+ N092 N099 0 0 0 N098 0 AND
A94 0V+ N094 N099 N104 0 0 N100 0 AND
A95 1V+ 0 0 0 0 N090 0 0 BUF
A97 1V+ 0 0 0 0 N091 0 0 BUF
A98 1V+ 0 0 0 0 N092 0 0 BUF
A99 0V+ 0 0 0 0 N093 0 0 BUF
A100 1V+ 0 0 0 0 N094 0 0 BUF
A101 1V+ 0 0 0 0 N095 0 0 BUF
A102 0V+ 0 0 0 0 N096 0 0 BUF
A96 1V+ N096 N099 N105 N104 0 N103 0 AND
A103 1V+ 1V+ 0 0 0 N104 0 0 XOR
A104 0V+ 1V+ 0 0 0 N105 0 0 XOR
A105 1V+ 0V+ 0 0 0 N107 0 0 XOR
A106 0 N104 N099 N105 N107 0 N106 0 AND
A107 N089 1V+ 0 0 0 0 N108 0 AND
A108 N108 N109 0 N111 N112 0 N110 0 OR
A109 N091 1V+ N099 0 0 0 N109 0 AND
A110 N093 1V+ N099 N105 N104 0 N111 0 AND
A111 N095 0V+ N099 N104 0 0 N112 0 AND
A112 N101 0 0 0 0 N102 0 0 BUF
* EBA2201p.asc: Elektronik simülasyon 35 temrini örneği.
* 01-5m • Temrin-35: Dört Bitlik Toplayıcı, Çıkarıcı ve Karşılaştırıcı Devreler. Toplayıcı devreleri, A ve B gibi iki farklı lojik sinyali toplayarak
*     çıkışa lojik olarak aktaran devrelerdir. Çıkarma devreleri de A ve B gibi iki farklı lojik sinyalin farkını alan devrelerdir. Çıkarma devreleri,
*     toplama işleminin değilini alarak işlemi gerçekleştirir. A ve B değerindeki iki sayıyı lojik bitleri olarak karşılaştıran ve istenilen şartlara uygun
*     olarak sonuca yansıtan devrelere karşılaştırıcı devreler denir. Bu devreler, iki sayıyı lojik olarak küçük (<), eşit (=) veya büyük (>) şekiller-
*     de karşılaştırır ve durumu sonuca (eşitse: 0-1-0) yansıtır.
*     -Sağdaki ilk toplayıcı devrede 8 bitli (2**8=256) sekizer An-Bn çiftleri, taşmaları bir soldaki büyük haneye aktararak 3 örnek sunmuştur
*     (255+1=256, 100+25=125, 193+18=211).
*     -Sağdaki ikinci çıkarıcı devrede 8 bitli (2**8=256) sekizer An-Bn çiftleri, NOT-B ve T0=1V+ yapılarak aynen A ve B değerleri önnceki gibi
*     girilerek An - Bn (100 - 25=75, 193 - 18=175) çıkarma 2 örnek sunulmuştur.
*     -Sağdaki üçüncü karşılaştırıcı devrede 4 bitli 0000/0-->1111/15 A3A2A1A0 ile 4 bitli B3B2B1B0 karşılaştırılıp A>B, A=B, A<B sonuçları
*     sonuç=1 veya 0 değeriyle alınır. 3 örnek test edilmiştir: 13>9 için üst=1, 12=12 için orta=1, 5<14 için alt=1 okur.
.tran 0 1mS 0
* A0
* B0
* Q0x1
* A1
* B1
* Q1x2
* A2
* B2
* Q2x4
* A3
* B3
* Q3x8
* A4
* B4
* Q4*16
* A5
* B5
* Q5x32
* A6
* B6
* Q6x64
* A7
* B7
* Q7x128
* T7
* T0
* Örnekler:
* A7A6A5A4A3A2A1A0 + B7B6B5B4B3B2B1B0=T7-Q7Q6Q5Q4Q3Q2Q1Q0
* 11111111/255 + 00000001 = 1-00000000/256
* 01100100/100 + 00011001/25 = 0-01111101/125
* 11000001/193 + 00010010/18 = 11010011/211
* NOT: Kullanılmayan (AND veya OR değil ama) XOR girişleri boş bırakılmazsa hata yapıyor.
* Taşma
* A0
* B0
* Q0x1
* A1
* B1
* Q1x2
* A2
* B2
* Q2x4
* A3
* B3
* Q3x8
* A4
* B4
* Q4*16
* A5
* B5
* Q5x32
* A6
* B6
* Q6x64
* A7
* B7
* Q7x128
* T7
* T0
* Taşma
* Örnekler:
* 01100100/100 - 00011001/25 = 01001011/75
* 11000001/193 - 00010010/18 = 10101111/175
* A0
* B0
* A1
* B1
* A2
* B2
* A3
* B3
* A0
* B0
* A1
* B1
* A2
* B2
* A3
* B3
* A>B
* A=B
* A<B
* Örnekler:
* 1101/13 > 1001/9
* 1100/12 = 1100/12
* 0101/5 < 1110/14
.backanno
.end